# EAGLE design switched-pwr (EAGLE 5.11)
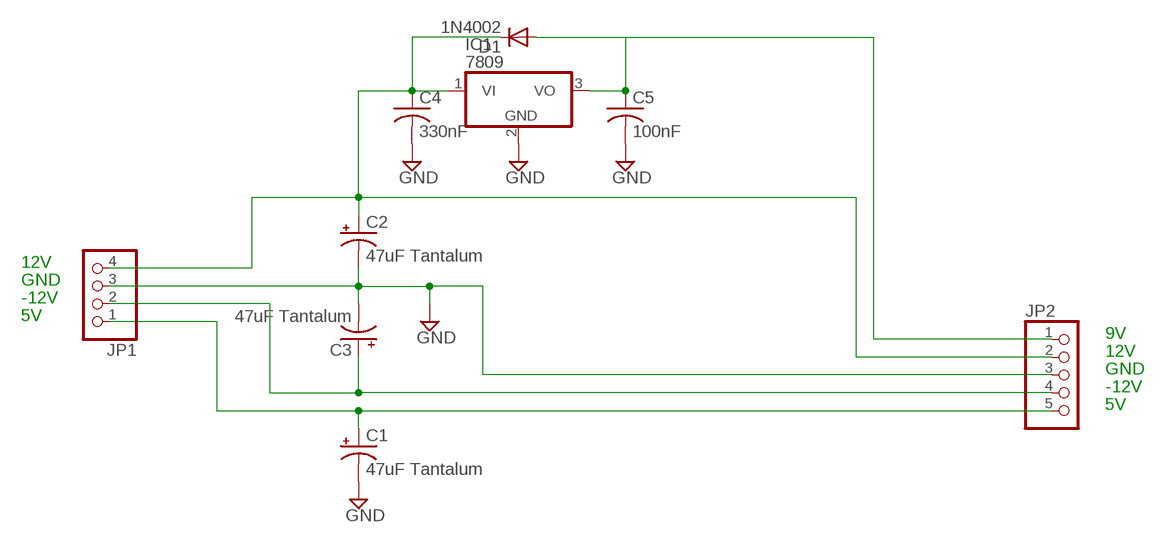
[diagram p0: schematic, sheet 1]

## Parts
C1  47uF Tantalum  CPOL-USE3.5-8  [E3,5-8]
C2  47uF Tantalum  CPOL-USE3.5-8  [E3,5-8]
C3  47uF Tantalum  CPOL-USE3.5-8  [E3,5-8]
C4  330nF  C-US025-030X050  [C025-030X050]
C5  100nF  C-US025-030X050  [C025-030X050]
D1  1N4002  1N4148DO35-10  [DO35-10]
IC1  7809  7805TV  [TO220V]
JP1  PINHD-1X4  [1X04]
JP2  PINHD-1X5  [1X05]

## Nets
GND: C1.- C2.- C3.- C4.2 C5.2 IC1.2(GND) JP1.3 JP2.3
N$3: C2.+ C4.1 D1.C IC1.1(VI) JP1.4 JP2.2
N$4: C3.+ JP1.2 JP2.4
N$5: C5.1 D1.A IC1.3(VO) JP2.1
N$6: C1.+ JP1.1 JP2.5

## Notes on the sheet
- 12V
- GND
- -12V
- 5V
- 9V
- 12V
- GND
- -12V
- 5V

## Library data of the parts
C1-C3 = rcl:CPOL-US: POLARIZED CAPACITOR, American symbol
C4 C5 = rcl:C-US: CAPACITOR, American symbol
D1 = diode:1N4148: DIODE high speed (Philips)
IC1 = linear:78*: Positive VOLTAGE REGULATOR Source: http://cache.national.com/ds/LM/LM78L05.pdf http://www.fairchildsemi.com/ds/LM/LM7805.pdf
JP1 = pinhead:PINHD-1X4: PIN HEADER
JP2 = pinhead:PINHD-1X5: PIN HEADER

## Board
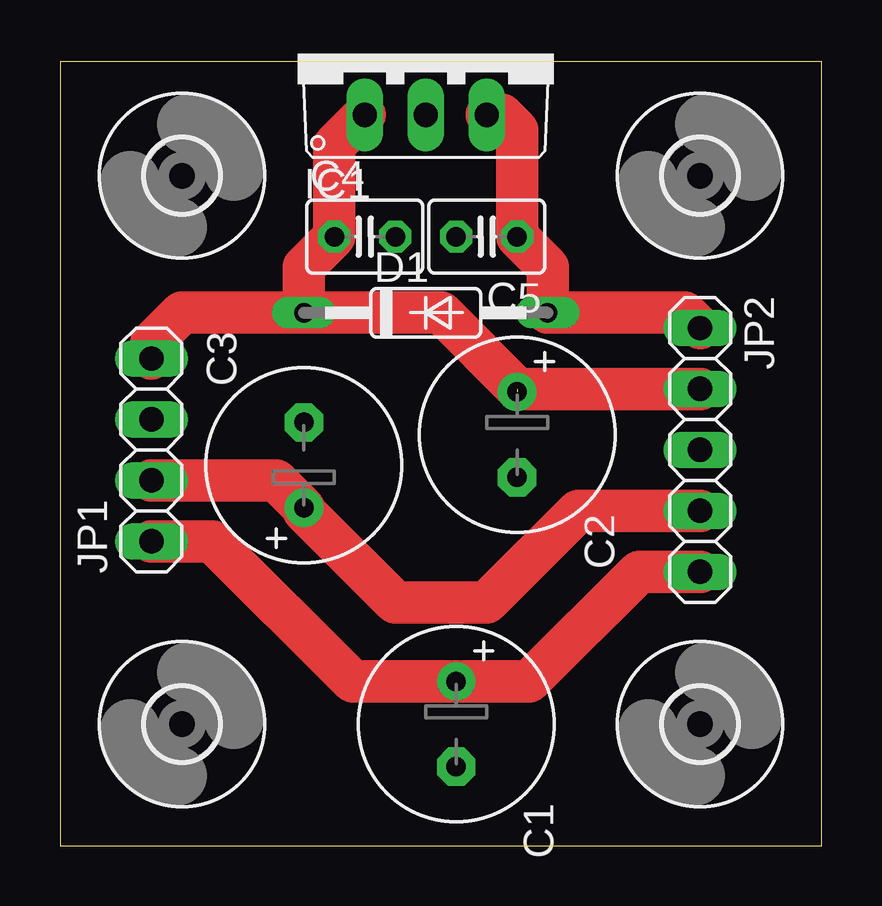
[diagram p1: board, top side]
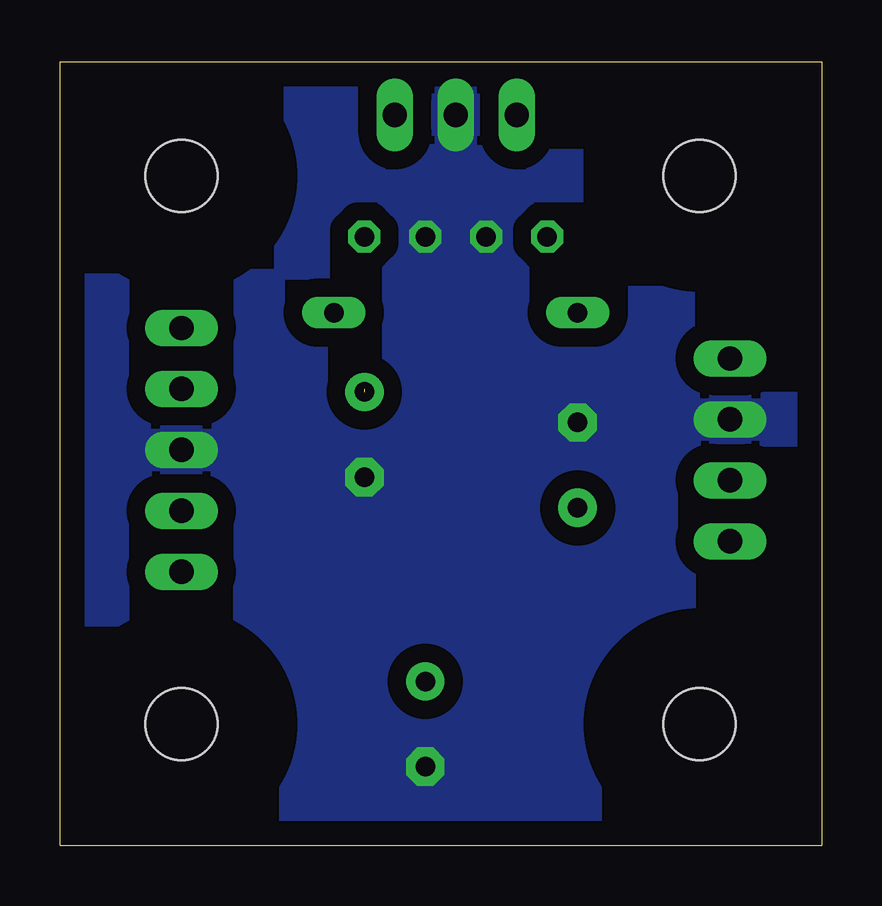
[diagram p2: board, bottom side, seen from below]

Size 31.73 x 32.69 mm. Coordinates in mm from the lower left corner, seen from the top.
Outline: 0,0 31.73,0 31.73,32.69 0,32.69 0,0
Copper layers (1*16): Top 0.035mm / dielectric 1.5mm / Bottom 0.035mm
Design rules "default": minimum track width 10mil, minimum drill 24mil, track to track 8mil, track to pad 8mil, pad to pad 8mil, via to via 8mil, smd to smd 8mil, copper to edge 40mil, drill to drill 8mil, minimum pad ring 10mil, minimum via ring 8mil, stop-mask expansion 4mil, vias tented up to drill 0mil, thermal gap 10mil

### Footprints (pad centres in the part's own frame; a part is rotated, then mirrored left to right if it is on the bottom)
E3,5-8 = drill 0.813 pad 1.6 round: + -1.778,0 | drill 0.813 pad 1.6 octagon: - 1.778,0
C025-030X050 = drill 0.813 octagon: 1 -1.27,0; 2 1.27,0
DO35-10 = drill 0.813 long: A 5.08,0; C -5.08,0
TO220V = drill 1.016 long: 1 -2.54,-2.54; 2 0,-2.54; 3 2.54,-2.54
1X04 = drill 1.016 long: 1 -3.81,0; 2 -1.27,0; 3 1.27,0; 4 3.81,0
1X05 = drill 1.016 long: 1 -5.08,0; 2 -2.54,0; 3 0,0; 4 2.54,0; 5 5.08,0
3,0 = hole 3: 0,0

### Placement (x,y rotation side)
C1  16.51,5.08 270 top
C2  19.05,17.14 270 top
C3  10.16,15.88 90 top
C4  12.7,25.4 0 top
C5  17.78,25.4 180 top
D1  15.24,22.23 0 top
IC1  15.24,33.02 0 top
JP1  3.81,16.51 90 top
JP2  26.67,16.51 270 top
U$1  [3,0]  5.08,5.08 0 top
U$2  [3,0]  5.08,27.94 0 top
U$3  [3,0]  26.67,27.94 0 top
U$4  [3,0]  26.67,5.08 0 top

### Tracks (layer width: path | path; a pad name or v marks a point on that pad's centre or on a via)
GND
  pour Bottom (isolate 0.762): -1.27,34.29 33.02,34.29 33.02,-2.54 -1.27,-2.54
N$3  (1 unrouted)
  Top 1.778: IC1.1 11.43,29.21 C4.1 10.16,24.13 D1.C | JP1.4 3.81,20.95 5.08,22.23 D1.C | D1.C 15.88,22.23 19.05,19.05 JP2.2
N$4
  Top 1.778: JP1.2 9.02,15.24 C3.+ 10.16,13.97 13.97,10.16 17.78,10.16 21.59,13.97 JP2.4
N$5
  Top 1.778: IC1.3 18.41,30.48 19.05,29.84 C5.1 20.32,24.13 D1.A 26.04,22.23 JP2.1
N$6
  Top 1.778: JP2.5 24.13,11.43 19.56,6.86 C1.+ 12.19,6.86 6.35,12.7 JP1.1